# EAGLE design UNDP_Shield_LoRa (EAGLE 9.6.2)
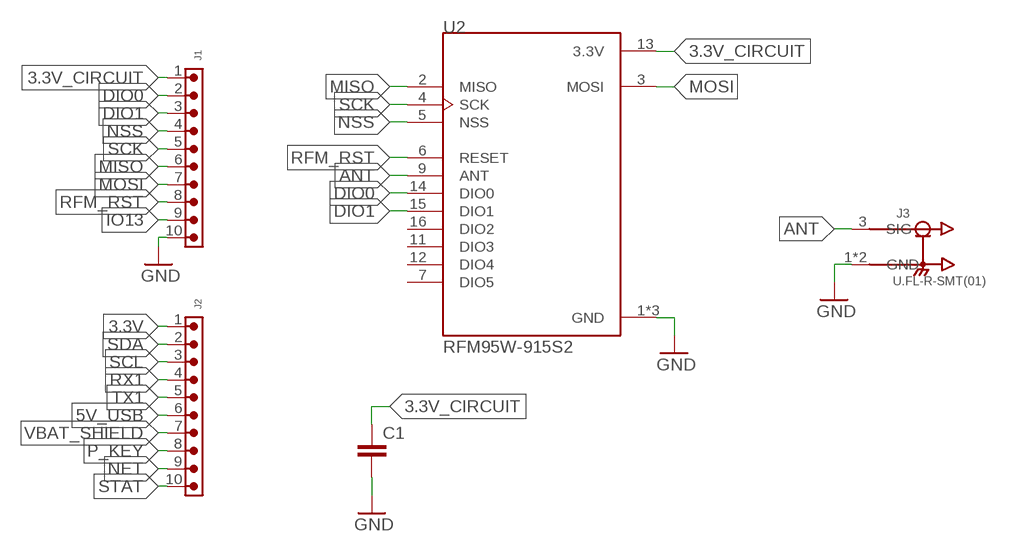
[diagram p0: schematic, sheet 1]

## Parts
C1  C-EUC0603  [C0603]
J1  6200XX11121_62001011121  [62001011121]
J2  6200XX11121_62001011121  [62001011121]
J3  U.FL-R-SMT(01)  [HRS_U.FL-R-SMT(01)]
U2  RFM95W-915S2  [XCVR_RFM95W-915S2]

## Nets
3.3V: J2.1
3.3V_CIRCUIT: C1.1 J1.1 U2.13(3.3V)
5V_USB: J2.6
ANT: J3.3(SIG) U2.9(ANT)
DIO0: J1.2 U2.14(DIO0)
DIO1: J1.3 U2.15(DIO1)
GND: C1.2 J1.10 J3.1(GND) J3.2(GND) U2.1(GND) U2.8(GND) U2.10(GND)
IO13: J1.9
MISO: J1.6 U2.2(MISO)
MOSI: J1.7 U2.3(MOSI)
NET: J2.9
NSS: J1.4 U2.5(NSS)
P_KEY: J2.8
RFM_RST: J1.8 U2.6(RESET)
RX1: J2.4
SCK: J1.5 U2.4(SCK)
SCL: J2.3
SDA: J2.2
STAT: J2.10
TX1: J2.5
VBAT_SHIELD: J2.7
Unconnected: U2.7(DIO5) U2.11(DIO3) U2.12(DIO4) U2.16(DIO2)

## Library data of the parts
C1 = rcl:C-EU: CAPACITOR, European symbol; SPICEPREFIX: C
J1 J2 = Wurth_Connectors_WR-PHD:6200XX11121_62001011121: WR-PHD 2.00 mm THT Pin Header ARTICLE PROPERTIES: Pins:2;​ 3;​ 4;​ 6;​ 8;​ 10;​ 20;​ 32 KIND PROPERTIES: Pitch：2 mm Quality Class:3 as per CECC 75 301-802 Rows：Single Gender：Pin Header Type：Straight MATERIAL PROPERTIES: Insulator Material :PA9T Insulator Flammability Rating:UL94 V-0 Contact Material:Copper Alloy Contact Plating:Gold Contact Type:Stamped GENERAL INFORMATION Operating Temperature:-40 up to +105 °C Compliance:Lead free / RoHS ELECTRICAL PROPERTIES: Rated Current:max.;​ 2 A IR 1:2A Withstanding Voltage:500 V (AC) Contact Resistance:20 mΩ RISO:1000 MΩ CERTIFICATION UL Approval:E323964 PACKAGING PROPERTIES Packaging:Bag Packaging Unit:1000;​ 500;​ 300;​ 200 <https://katalog.we-online.com/media/images/v2/o33219v209%20Family_WR-PHD_6200xx11121.jpg> Details see: https://katalog.we-online.com/en/em/PHD_2_00_THT_PIN_HEADER_6200XX11121 Updated by Yingchun,Shan 2019-10-24 2019 (C) Würth Elektronik; DATASHEET-URL: https://katalog.we-online.com/em/datasheet/62001011121.pdf; GENDER: Pin Header; IR: 2A; MATES: WR-PHD 2.0mm Socket Header; PACKAGING: Bag; PART-NUMBER: 62001011121; PINS: 10; ROWS: Single; TYPE: Straight
J3 = U.FL-R-SMT_01_:U.FL-R-SMT(01): U.FL Series 6 Ghz 50 Ohm Ultra-small SMT Coaxial Cable Receptacle Check prices <https://pricing.snapeda.com/parts/U.FL-R-SMT%2801%29/Hirose/view-part?ref=eda>; AVAILABILITY: In Stock; DESCRIPTION: U.FL (UMCC) Connector Receptacle, Male Pin 50Ohm Surface Mount Solder. RF Connectors / Coaxial Connectors; MF: Hirose; MP: U.FL-R-SMT(01); PACKAGE: None; PRICE: None; PURCHASE-URL: https://pricing.snapeda.com/search/part/U.FL-R-SMT(01)/?ref=eda
U2 = RFM95W-915S2:RFM95W-915S2: RFM95(W) - Low Power Long Range Transceiver Module V1.0; AVAILABILITY: Unavailable; DESCRIPTION: General ISM < 1GHz LoRa™ Transceiver Module 915MHz Surface Mount; MF: RF Solutions; MP: RFM95W-915S2; PACKAGE: SMD-16 RF Solutions; PRICE: None

## Board
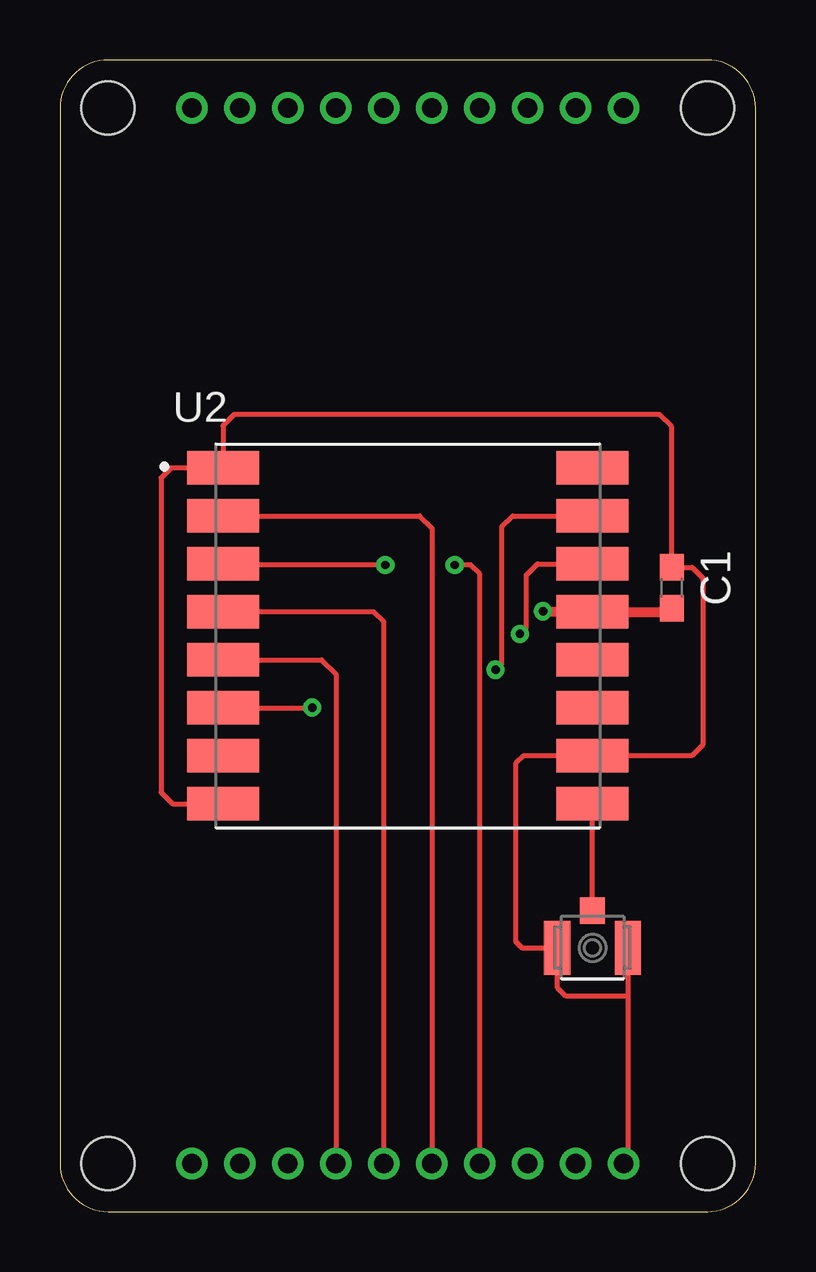
[diagram p1: board, top side]
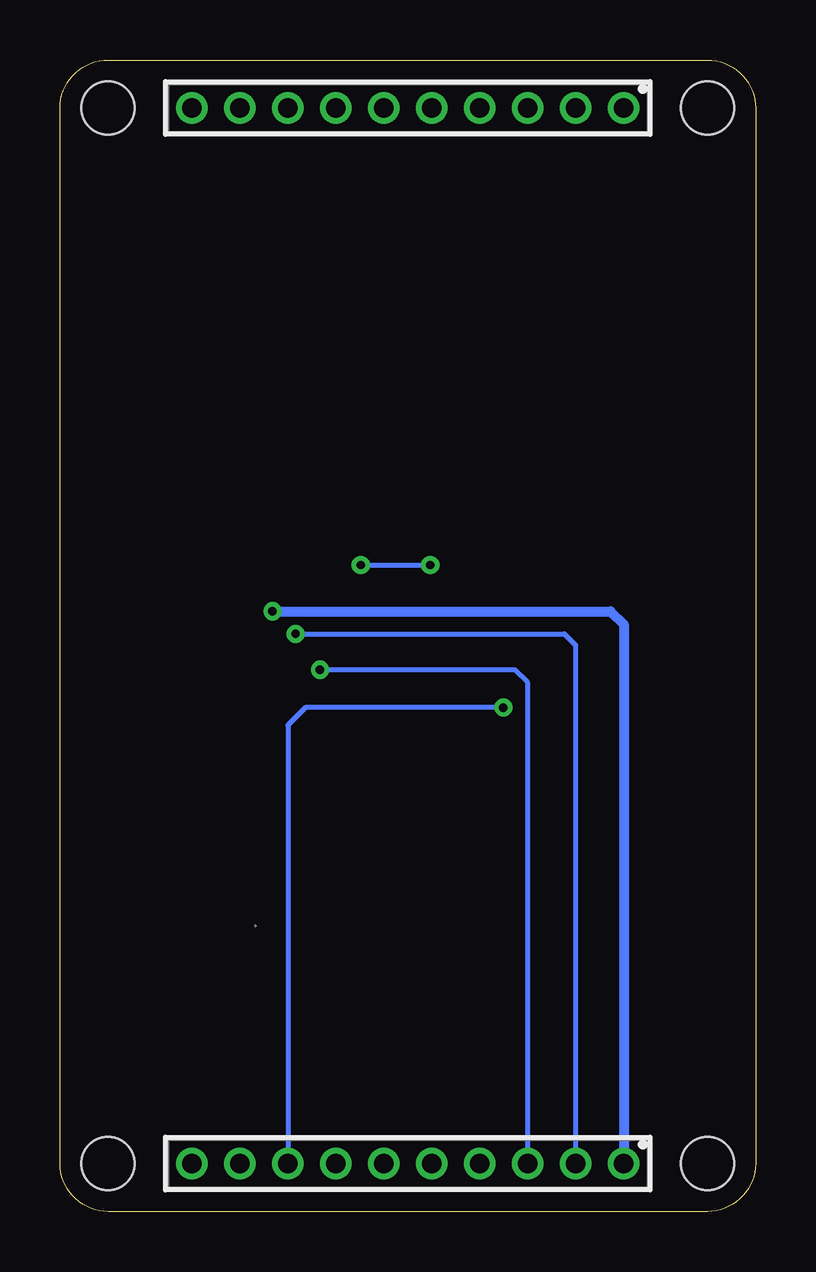
[diagram p2: board, bottom side, seen from below]

Size 29 x 48 mm. Coordinates in mm from the lower left corner, seen from the top.
Outline: 0,46 0,2 arc90 2,0 27,0 arc90 29,2 29,46 arc90 27,48 2,48 arc90 0,46
Copper layers (1*16): Top 0.035mm / dielectric 1.5mm / Bottom 0.035mm
Design rules "default": minimum track width 6mil, minimum drill 0.35mm, track to track 6mil, track to pad 6mil, pad to pad 6mil, via to via 6mil, smd to smd 6mil, copper to edge 40mil, drill to drill 6mil, minimum pad ring 10mil, minimum via ring 8mil, stop-mask expansion 4mil, vias tented up to drill 0mil, thermal gap 10mil
Holes 2.2 mm at 2,2 27,2 27,46 2,46

### Footprints (pad centres in the part's own frame; a part is rotated, then mirrored left to right if it is on the bottom)
C0603 = smd 1.1 x 1: 1 -0.85,0; 2 0.85,0
62001011121 = drill 0.8: 1 -9,0; 2 -7,0; 3 -5,0; 4 -3,0; 5 -1,0; 6 1,0; 7 3,0; 8 5,0; 9 7,0; 10 9,0
HRS_U.FL-R-SMT(01) = smd 1.1 x 2.25: 1 -1.475,0; 2 1.475,0 | smd 1.05 x 1.1: 3 0,-1.55
XCVR_RFM95W-915S2 = smd 3 x 1.4: 1 -7.7,7; 2 -7.7,5; 3 -7.7,3; 4 -7.7,1; 5 -7.7,-1; 6 -7.7,-3; 7 -7.7,-5; 8 -7.7,-7; 9 7.7,-7; 10 7.7,-5; 11 7.7,-3; 12 7.7,-1; 13 7.7,1; 14 7.7,3; 15 7.7,5; 16 7.7,7

### Placement (x,y rotation side)
C1  25.5,26 90 top
J1  14.5,2 180 bottom
J2  14.5,46 180 bottom
J3  22.2,11 180 top
U2  14.5,24 0 top

### Tracks (layer width: path | path; a pad name or v marks a point on that pad's centre or on a via)
3.3V_CIRCUIT  (via drill 0.35)
  Top 0.406: C1.1 25.35,25 U2.13 20.16,25 v20.14,25.02
  Bottom 0.406: v20.14,25.02 6.04,25.02 5.5,24.47 J1.1
ANT
  Top 0.213: J3.3 U2.9
DIO0  (via drill 0.35)
  Top 0.203: U2.14 19.91,27 19.43,26.52 19.43,24.33 v19.18,24.08
  Bottom 0.203: J1.2 7.5,23.6 7.98,24.08 v19.18,24.08
DIO1  (via drill 0.35)
  Top 0.203: v18.16,22.58 18.41,22.84 18.41,28.55 18.86,29 U2.15
  Bottom 0.203: J1.3 9.5,22.05 10.03,22.58 v18.16,22.58
GND
  Top 0.203: 23.68,8.99 21.08,8.99 20.73,9.35 J3.2 19.25,11 19,11.25 19,18.67 19.33,19 U2.10 26.34,19 26.8,19.46 26.8,26.42 26.36,26.85 C1.2 25.5,32.72 24.99,33.22 7.26,33.22 6.8,32.76 U2.1 4.63,31 4.22,30.58 4.22,17.48 4.69,17 U2.8 | J3.1 23.68,8.99 | 23.68,8.99 23.68,2.17 J1.10
MISO
  Top 0.203: U2.2 14.99,29 15.5,28.49 J1.6
MOSI  (via drill 0.35)
  Top 0.203: J1.7 17.5,26.57 17.12,26.95 v16.46,26.95 | v13.56,26.95 6.85,26.95 U2.3
  Bottom 0.203: v16.46,26.95 v13.56,26.95
NSS
  Top 0.203: U2.5 10.91,23 11.5,22.41 J1.4
RFM_RST  (via drill 0.35)
  Top 0.203: U2.6 v10.51,21 v10.52,21.01
  Bottom 0.203: v10.52,21.01 18.77,21.01 19.5,20.28 J1.8
SCK
  Top 0.203: J1.5 13.5,24.57 13.07,25 U2.4